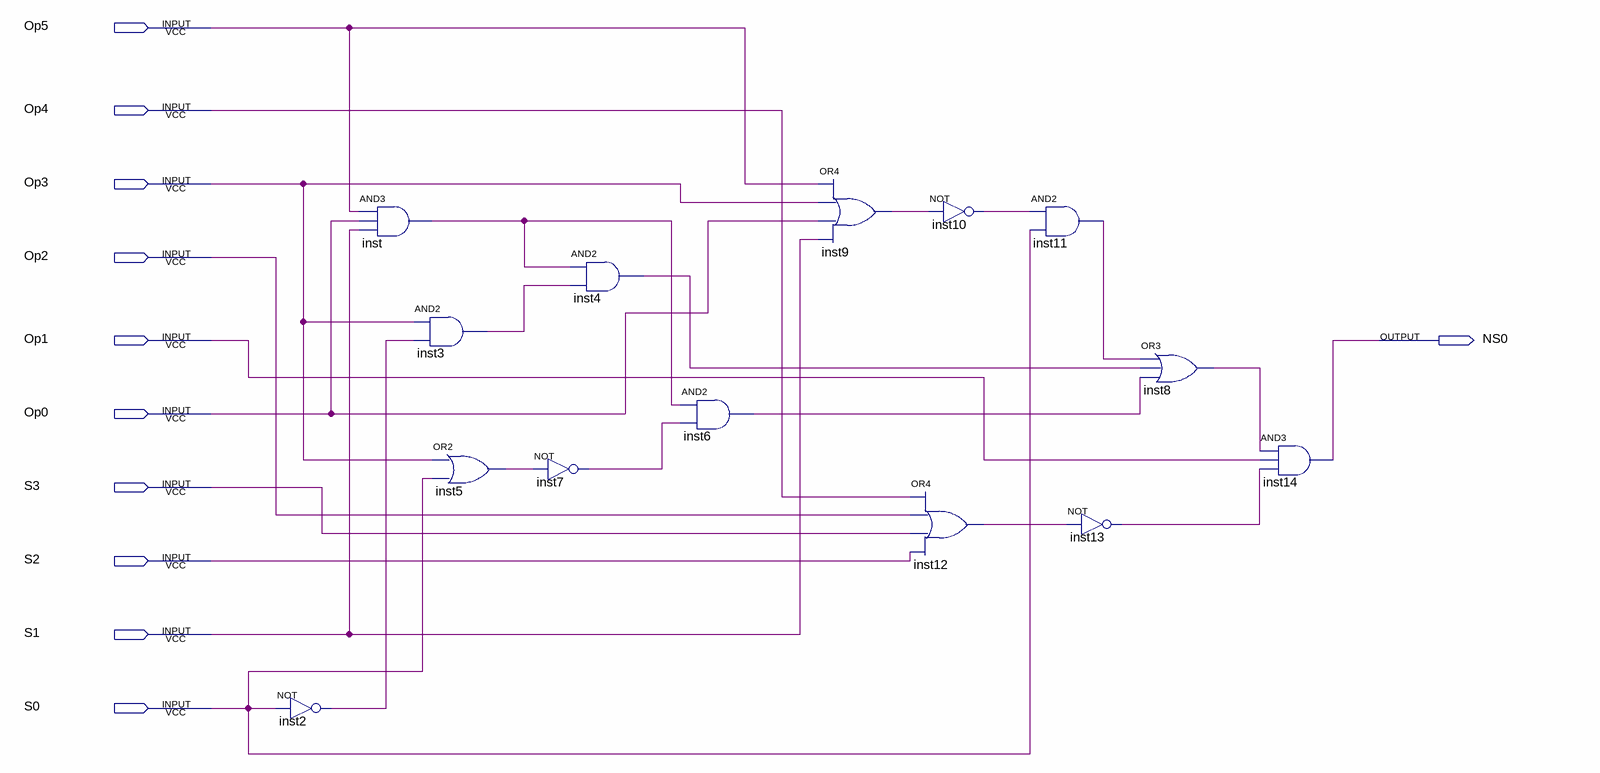
[diagram p0: schematic sheet]
// Quartus schematic NS0.bdf as structural Verilog: 14 symbols, 11 pins
module NS0 (
  input  Op5,
  input  Op4,
  input  Op3,
  input  Op2,
  input  Op1,
  input  Op0,
  input  S3,
  input  S2,
  input  S1,
  input  S0,
  output NS0
);

  wire inst2_out, inst3_out, inst4_out, inst5_out, inst6_out, inst7_out, inst8_out, inst9_out, inst10_out,
       inst11_out, inst12_out, inst13_out, inst_out;

  not inst2 (inst2_out, S0);
  and inst (inst_out, Op5, Op0, S1);
  and inst3 (inst3_out, Op3, inst2_out);
  or inst5 (inst5_out, Op3, S0);
  and inst4 (inst4_out, inst_out, inst3_out);
  not inst7 (inst7_out, inst5_out);
  and inst6 (inst6_out, inst_out, inst7_out);
  or inst9 (inst9_out, Op5, Op3, Op0, S1);
  not inst10 (inst10_out, inst9_out);
  or inst12 (inst12_out, Op4, Op2, S3, S2);
  and inst11 (inst11_out, inst10_out, S0);
  not inst13 (inst13_out, inst12_out);
  or inst8 (inst8_out, inst11_out, inst4_out, inst6_out);
  and inst14 (NS0, inst8_out, Op1, inst13_out);
endmodule
